# Altium project WS3.0.PrjPCB
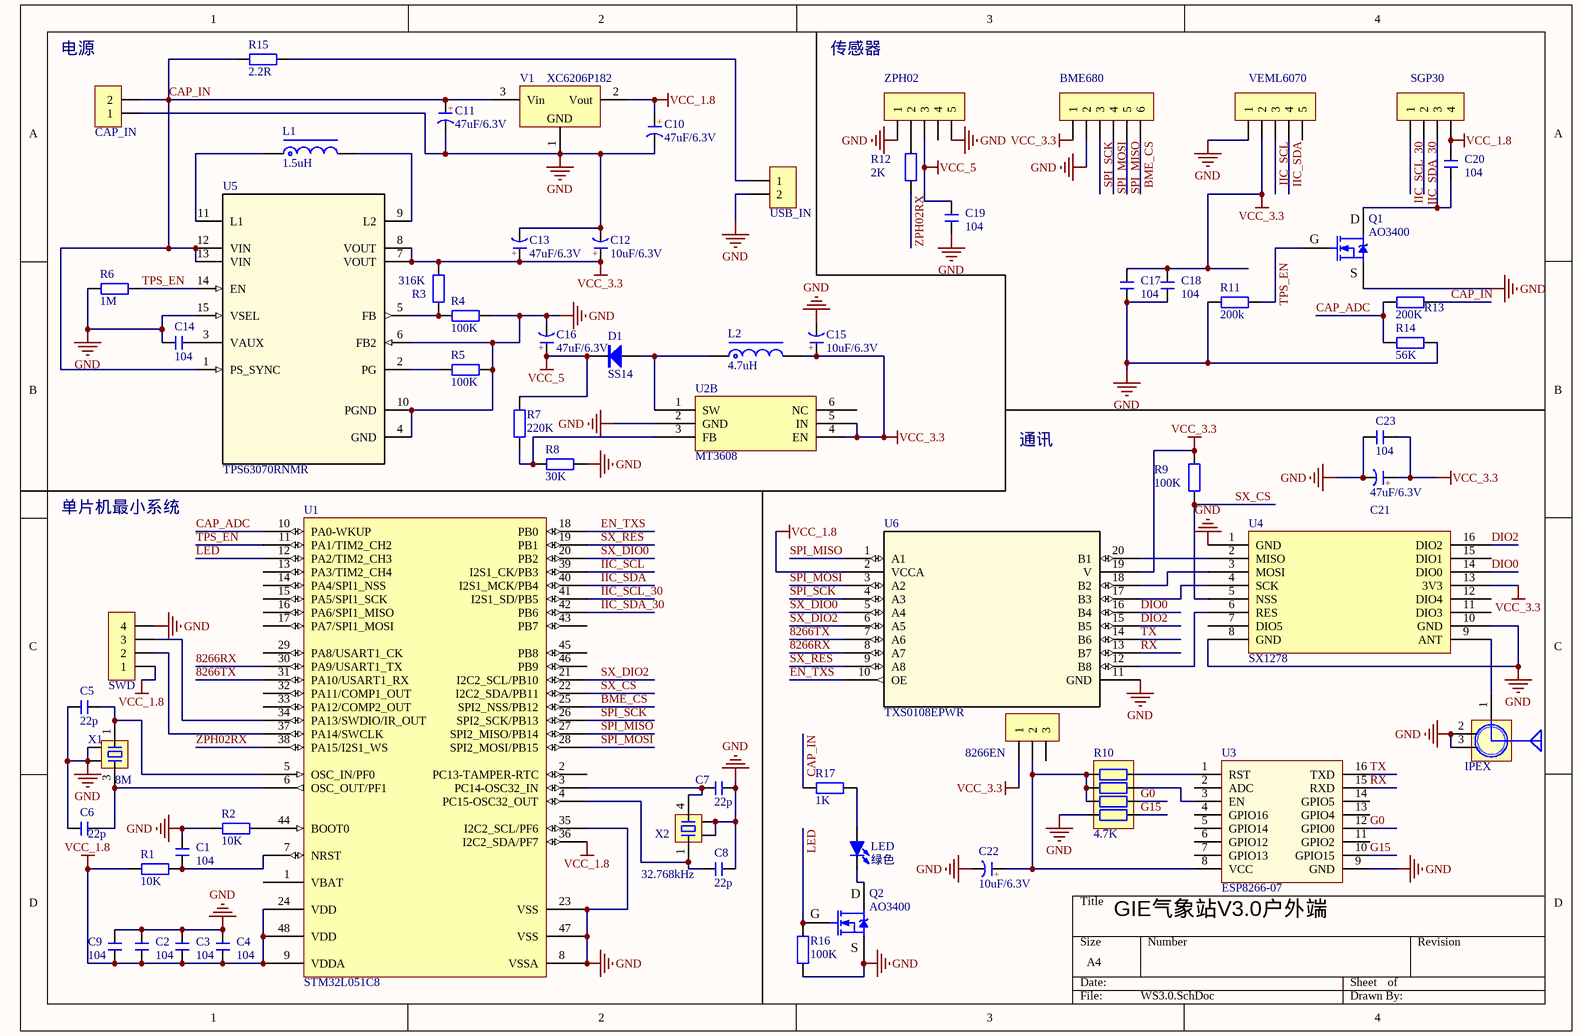
[diagram p0: WS3.0.SchDoc]
2 sheets, 120 parts. Net scope: global (net labels, ports and power ports of the same name join across sheets).
Board files: WS3.0.PcbDoc, WS3.0_DISP.PcbDoc
Sheets:
  WS3.0.SchDoc
  WS3.0_DISP.SchDoc

## Sheet WS3.0.SchDoc
size A4

### Parts
(Parts that share a designator on the sheet are numbered #1, #2 ... from top to bottom, then left to right.)
8266EN  HDR-1X3  [HDR2.54-LI-3P]  (value not drawn)
?  IPEX  [IPEX]
BME680  HDR-1X6  [HDR2.54-LI-6P]  (value not drawn)
C1#1  104  [C 0603_L]
C2#1  104  [C 0603_L]
C3#1  104  [C 0603_L]
C4#1  104  [C 0603_L]
C5#1  22p  [C 0603_L]
C6#1  22p  [C 0603_L]
C7#1  22p  [C 0603_L]
C8#1  22p  [C 0603_L]
C9#1  104  [C 0603_L]
C10#1  47uF/6.3V  [CD A(3216)]
C11#1  47uF/6.3V  [CD A(3216)]
C12#1  10uF/6.3V  [CD S(2012)]
C13#1  47uF/6.3V  [CD A(3216)]
C14#1  104  [C 0603_L]
C15#1  10uF/6.3V  [CD S(2012)]
C16#1  47uF/6.3V  [CD A(3216)]
C17#1  104  [C 0603_L]
C18#1  104  [C 0603_L]
C19#1  104  [C 0603_L]
C20#1  104  [C 0603_L]
C21#1  47uF/6.3V  [CD A(3216)]
C22#1  10uF/6.3V  [CD S(2012)]
C23  104  [C 0603_L]
CAP_IN  HDR-1X2  [HDR2.54-LI-2P]  (value not drawn)
D1  SS14  [SOD-523]
L1  1.5uH  [NR4020]
L2  4.7uH  [L-SMD-0630]
LED  绿色  [LED 0805G]
Q1#1  AO3400  [SOT23-3N]
Q2#1  AO3400  [SOT23-3N]
R1#1  10K  [R 0603_L]
R2#1  10K  [R 0603_L]
R3  316K  [R 0603_L]
R4#1  100K  [R 0603_L]
R5#1  100K  [R 0603_L]
R6#1  1M  [R 0603_L]
R7#1  220K  [R 0603_L]
R8#1  30K  [R 0603_L]
R9#1  100K  [R 0603_L]
R10#1  4.7K  [RCA-8P4R-0603]
R11#1  200k  [R 0603_L]
R12#1  2K  [R 0603_L]
R13#1  200K  [R 0603_L]
R14#1  56K  [R 0603_L]
R15  2.2R  [RS 3W]
R16  100K  [R 0603_L]
R17  1K  [R 0603_L]
SGP30  HDR-1X4  [HDR2.54-LI-4P]  (value not drawn)
SWD#1  HDR-1X4  [HDR2.54-LI-4P]  (value not drawn)
U1#1  STM32L051C8  [LQFP48 7X7_M]
U2#1  MT3608  [SOT23-6L]  (part B of 2)
U3#1  ESP8266-07  [ESP-07]
U4#1  SX1278  [SX1278]
U5#1  TPS63070RNMR  [RNM0015A]
U6#1  TXS0108EPWR  [PW20]
USB_IN  HDR-1X2  [HDR2.54-LI-2P]  (value not drawn)
V1#1  XC6206P182  [SOT23-3M]
VEML6070  HDR-1X5  [HDR2.54-LI-5P]  (value not drawn)
X1#1  8M  [OSC 3225-4P]
X2#1  32.768kHz  [OSC MC-146]
ZPH02  HDR-1X5  [HDR2.54-LI-5P]  (value not drawn)

### Nets
GND: ?.2(GND) ?.3(GND) BME680.2 C1#1.2 C2#1.2 C3#1.2 C4#1.2 C5#1.1 C6#1.1 C7#1.2 C8#1.2 C9#1.2 C10#1.2(K) C11#1.2(K) C12#1.2(K) C13#1.2(K) C14#1.2 C15#1.2(K) C16#1.2(K) C17#1.1 C18#1.1 C19#1.1 C21#1.2(K) C22#1.2(K) C23.2 CAP_IN.1 Q1#1.2(S) Q2#1.2(S) R2#1.1 R4#1.2 R5#1.2 R6#1.1 R8#1.2 R10#1.4 R11#1.2 R14#1.1 R16.2 SWD#1.4 U1#1.8(VSSA) U1#1.23(VSS) U1#1.35(I2C2_SCL/PF6) U1#1.47(VSS) U2#1.2(GND) U3#1.9(GND) U4#1.1(GND) U4#1.8(GND) U4#1.10(GND) U5#1.4(GND) U5#1.6(FB2) U5#1.10(PGND) U5#1.15(VSEL) U6#1.11(GND) USB_IN.2 V1#1.1(GND) VEML6070.1 X1#1.2 X1#1.4 X2#1.2 X2#1.3 ZPH02.1 ZPH02.5
VCC_1.8: C2#1.1 C3#1.1 C4#1.1 C9#1.1 C10#1.1(A) C20#1.2 R1#1.1 SGP30.4 SWD#1.1 U1#1.9(VDDA) U1#1.24(VDD) U1#1.36(I2C2_SDA/PF7) U1#1.48(VDD) U6#1.2(VCCA) V1#1.2(Vout)
VCC_3.3: 8266EN.1 BME680.1 C12#1.1(A) C13#1.1(A) C15#1.1(A) C17#1.2 C18#1.2 C21#1.1(A) C23.1 L2.2 R3.2 R9#1.2 U2#1.4(EN) U2#1.5(IN) U4#1.13(3V3) U5#1.7(VOUT) U5#1.8(VOUT) U6#1.19(V) VEML6070.2
VCC_5: C16#1.1(A) C19#1.2 D1.2(K) R7#1.2 ZPH02.3
8266RX: U1#1.30(PA9/USART1_TX) U6#1.8(A7)
8266TX: U1#1.31(PA10/USART1_RX) U6#1.7(A6)
BME_CS: BME680.6 U1#1.25(SPI2_NSS/PB12)
CAP_ADC: R13#1.2 R14#1.2 U1#1.10(PA0-WKUP)
CAP_IN: C11#1.1(A) CAP_IN.2 R13#1.1 R15.1 R17.2 U5#1.1(PS_SYNC) U5#1.12(VIN) U5#1.13(VIN) V1#1.3(Vin)
DIO0: U4#1.14(DIO0) U6#1.16(B4)
DIO2: U4#1.16(DIO2) U6#1.15(B5)
EN_TXS: U1#1.18(PB0) U6#1.10(OE)
G0: R10#1.6 U3#1.12(GPIO0)
G15: R10#1.5 U3#1.10(GPIO15)
IIC_SCL: U1#1.39(I2S1_CK/PB3) VEML6070.3
IIC_SCL_30: SGP30.1 U1#1.41(I2S1_SD/PB5)
IIC_SDA: U1#1.40(I2S1_MCK/PB4) VEML6070.4
IIC_SDA_30: SGP30.2 U1#1.42(PB6)
LED: Q2#1.1(G) R16.1 U1#1.12(PA2/TIM2_CH3)
RX: U3#1.15(RXD) U6#1.13(B7)
SPI_MISO: BME680.5 U1#1.27(SPI2_MISO/PB14) U6#1.1(A1)
SPI_MOSI: BME680.4 U1#1.28(SPI2_MOSI/PB15) U6#1.3(A2)
SPI_SCK: BME680.3 U1#1.26(SPI2_SCK/PB13) U6#1.4(A3)
SX_CS: R9#1.1 U1#1.22(I2C2_SDA/PB11) U4#1.5(NSS)
SX_DIO0: U1#1.20(PB2) U6#1.5(A4)
SX_DIO2: U1#1.21(I2C2_SCL/PB10) U6#1.6(A5)
SX_RES: U1#1.19(PB1) U6#1.9(A8)
TPS_EN: Q1#1.1(G) R6#1.2 R11#1.1 U1#1.11(PA1/TIM2_CH2) U5#1.14(EN)
TX: U3#1.16(TXD) U6#1.14(B6)
ZPH02RX: R12#1.1 U1#1.38(PA15/I2S1_WS)
Net8266EN_2: 8266EN.2 C22#1.1(A) R10#1.1 R10#1.2 R10#1.3 U3#1.8(VCC)
Net?_1: ?.1(ANT) U4#1.9(ANT)
NetC1#1_1: C1#1.1 R1#1.2 U1#1.7(NRST)
NetC5#1_2: C5#1.2 U1#1.5(OSC_IN/PF0) X1#1.1
NetC6#1_2: C6#1.2 U1#1.6(OSC_OUT/PF1) X1#1.3
NetC7#1_1: C7#1.1 U1#1.3(PC14-OSC32_IN) X2#1.4
NetC8#1_1: C8#1.1 U1#1.4(PC15-OSC32_OUT) X2#1.1
NetC14#1_1: C14#1.1 U5#1.3(VAUX)
NetC20#1_1: C20#1.1 Q1#1.3(D) SGP30.3
NetD1_1: D1.1(A) L2.1 U2#1.1(SW)
NetL1_1: L1.1 U5#1.11(L1)
NetL1_2: L1.2 U5#1.9(L2)
NetLED_1: LED.1(A) R17.1
NetLED_2: LED.2(K) Q2#1.3(D)
NetR2#1_2: R2#1.2 U1#1.44(BOOT0)
NetR3_1: R3.1 R4#1.1 U5#1.5(FB)
NetR5#1_1: R5#1.1 U5#1.2(PG)
NetR7#1_1: R7#1.1 R8#1.1 U2#1.3(FB)
NetR10#1_7: R10#1.7 U3#1.3(EN)
NetR10#1_8: R10#1.8 U3#1.1(RST)
NetR12#1_2: R12#1.2 ZPH02.2
NetR15_2: R15.2 USB_IN.1
NetSWD#1_2: SWD#1.2 U1#1.37(PA14/SWCLK)
NetSWD#1_3: SWD#1.3 U1#1.34(PA13/SWDIO/IR_OUT)
NetU4#1_2: U4#1.2(MISO) U6#1.20(B1)
NetU4#1_3: U4#1.3(MOSI) U6#1.18(B2)
NetU4#1_4: U4#1.4(SCK) U6#1.17(B3)
NetU4#1_6: U4#1.6(RES) U6#1.12(B8)

Not connected (* = marked no-connect by the designer): 8266EN 3; U1#1 1(VBAT) 2(PC13-TAMPER-RTC) 13(PA3/TIM2_CH4) 14(PA4/SPI1_NSS) 15(PA5/SPI1_SCK) 16(PA6/SPI1_MISO) 17(PA7/SPI1_MOSI) 29(PA8/USART1_CK) 32(PA11/COMP1_OUT) 33(PA12/COMP2_OUT) 43(PB7) 45(PB8) 46(PB9); U2#1 6(NC); U3#1 2(ADC) 4(GPIO16) 5(GPIO14) 6(GPIO12) 7(GPIO13) 11(GPIO2) 13(GPIO4) 14(GPIO5); U4#1 7(DIO5) 11(DIO3) 12(DIO4) 15(DIO1); VEML6070 5; ZPH02 4

### Notes on the sheet
- 电源
- 传感器
- 通讯
- 单片机最小系统
- (near U3#1) GIE气象站V3.0户外端
- (in symbol C-CD) +

### Library data of the parts
8266EN = Header 3: 3P接插件; 版权归属: 源创客; BOM名称: 3P接插件; 学习资源: www.ooocke.com
? = SMA: SMA-2.4G射频天线接口; 版权归属: 源创客; BOM名称: SMA-2.4G射频天线接口; 学习资源: www.ooocke.com
BME680 = Header 6: 6P接插件; 版权归属: 源创客; BOM名称: 6P接插件; 学习资源: www.ooocke.com
C1#1 C2#1 C3#1 C4#1 C5#1 C6#1 C7#1 C8#1 C9#1 C14#1 C17#1 C18#1 C19#1 C20#1 C23 = C: 无极性贴片电容; 版权归属: 源创客; BOM名称: 无极性贴片电容; 学习资源: www.ooocke.com
C10#1 C11#1 C12#1 C13#1 C15#1 C16#1 C21#1 C22#1 = C-CD: 贴片钽电容; 版权归属: 源创客; BOM名称: 贴片钽电容; 学习资源: www.ooocke.com
CAP_IN USB_IN = Header 2: 2P接插件; 版权归属: 源创客; BOM名称: 2P接插件; 学习资源: www.ooocke.com
D1 = SS14: 肖特基二极管; 版权归属: 源创客; 属性: 40V/1A; BOM名称: 肖特基二极管; 学习资源: www.ooocke.com
L1 L2 = L-NR: NR磁胶电感; 版权归属: 源创客; BOM名称: NR磁胶电感; 学习资源: www.ooocke.com
LED = LED-SMD: 贴片LED; 版权归属: 源创客; BOM名称: 贴片LED; 学习资源: www.ooocke.com
Q1#1 Q2#1 = SI2302: N沟道场效应管; 版权归属: 源创客; BOM名称: N沟道场效应管; 学习资源: www.ooocke.com
R1#1 R2#1 R3 R4#1 R5#1 R6#1 R7#1 R8#1 R9#1 R11#1 R12#1 R13#1 R14#1 R16 R17 = R: 贴片电阻; 版权归属: 源创客; BOM名称: 贴片电阻; 学习资源: www.ooocke.com
R10#1 = R-8P4R: 贴片网络排阻; 版权归属: 源创客; BOM名称: 贴片网络排阻; 学习资源: www.ooocke.com
R15 = R-I: 电流检测电阻; 版权归属: 源创客; BOM名称: 电流检测电阻; 学习资源: www.ooocke.com
SGP30 SWD#1 = Header 4: 4P接插件; 版权归属: 源创客; BOM名称: 4P接插件; 学习资源: www.ooocke.com
U1#1 = STM32F051C8: Flaah:64/RAM:20/IO:36; BOM名称: 32位STM单片机; 版权归属: 源创客; 学习资源: www.ooocke.com
U3#1 = ESP8266-07: 串口 WIFI模块，ESP-07; BOM名称: WIFI模块; 版权归属: 源创客; 学习资源: www.ooocke.com
U5#1 = TPS630701RNMR: No Description Available; Manufacturer: Texas Instruments; PartNumber: TPS63070RNMR; RefDes: RefDes; Type: DEV; Value: Value; Copyright: Copyright (C) 2018 Accelerated Designs. All rights reserved
U6#1 = TXS0108EPWR: 8-Bit Bidirectional Voltage-Level Translator For Open-Drain And Push-Pull Application; Vendor: Texas Instruments; PACKAGE_DESIGNATOR: PW; PIN_COUNT: 20; FAMILY_NAME: AUTO DIRECTION SENSING DUAL SUPPLY TRANSLATOR; INDUSTRY_STD_PKG_TYPE: TSSOP; Manufacturer_Part_Number: TXS0108EPWR; GENERIC_PART_NUMBER: TXS0108E; Datasheet_URL: http://www.ti.com/lit/gpn/TXS0108E; Manufacturer: Texas Instruments; Copyright: Copyright (C) 2018 Accelerated Designs. All rights reserved; RefDes: RefDes; Type: DEV
V1#1 = AMS1117: 三端稳压芯片; BOM名称: 稳压芯片; 版权归属: 源创客; 学习资源: www.ooocke.com
VEML6070 ZPH02 = Header 5: 5P接插件; 版权归属: 源创客; BOM名称: 5P接插件; 学习资源: www.ooocke.com
X1#1 = XTAL-4P: 4脚无源晶振; 版权归属: 源创客; BOM名称: 4脚无源晶振; 学习资源: www.ooocke.com
X2#1 = XTAL-MC-4P: MC系列4脚晶振; BOM名称: 2脚无源脚晶振; 版权归属: 源创客; 学习资源: www.ooocke.com

## Sheet WS3.0_DISP.SchDoc
size A4
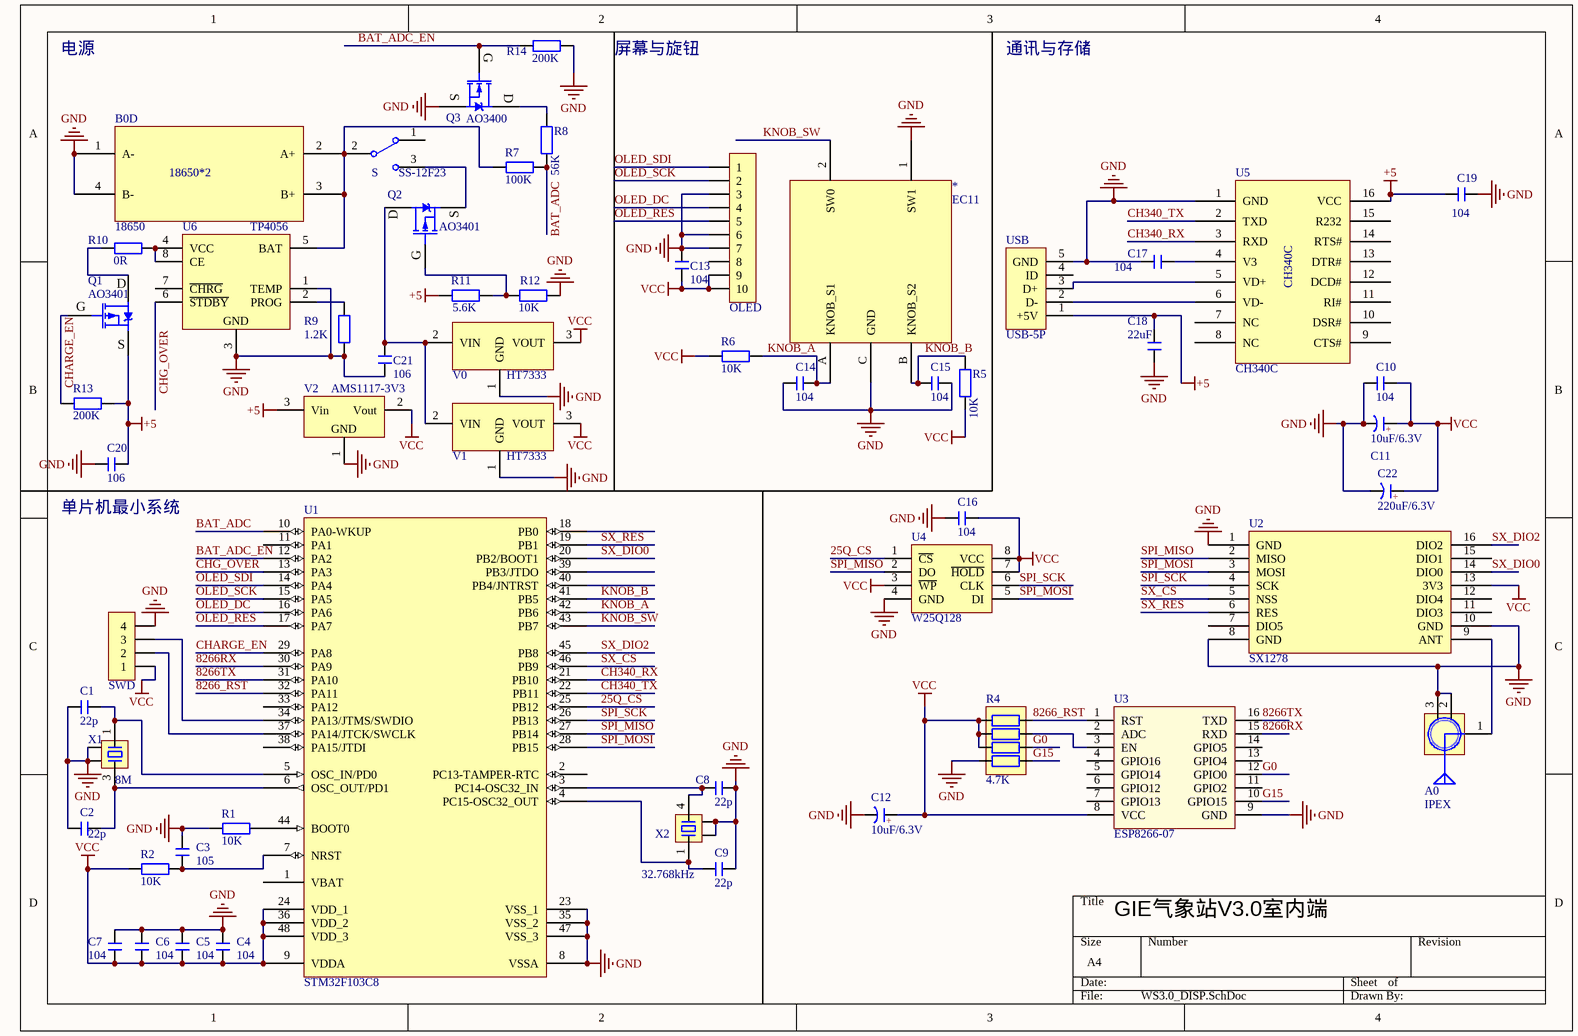
[diagram p1: WS3.0_DISP.SchDoc]

### Parts
(Parts that share a designator on the sheet are numbered #1, #2 ... from top to bottom, then left to right.)
*  EC11  [EC11]
A0  IPEX  [IPEX]
B0  18650  [18650]  (part D of 4)
C1#2  22p  [C 0603_L]
C2#2  22p  [C 0603_L]
C3#2  105  [C 0603_L]
C4#2  104  [C 0603_L]
C5#2  104  [C 0603_L]
C6#2  104  [C 0603_L]
C7#2  104  [C 0603_L]
C8#2  22p  [C 0603_L]
C9#2  22p  [C 0603_L]
C10#2  104  [C 0603_L]
C11#2  10uF/6.3V  [CD S(2012)]
C12#2  10uF/6.3V  [CD S(2012)]
C13#2  104  [C 0603_L]
C14#2  104  [C 0603_L]
C15#2  104  [C 0603_L]
C16#2  104  [C 0603_L]
C17#2  104  [C 0603_L]
C18#2  22uF  [C 0805_L]
C19#2  104  [C 0603_L]
C20#2  106  [C 0805_L]
C21#2  106  [C 0805_L]
C22#2  220uF/6.3V  [CD B(3528)]
OLED  FPC1.0-10P  [FPC1.0-2H-WS-10P]  (value not drawn)
Q1#2  AO3401  [SOT23-3N]
Q2#2  AO3401  [SOT23-3N]
Q3  AO3400  [SOT23-3N]
R1#2  10K  [R 0603_L]
R2#2  10K  [R 0603_L]
R4#2  4.7K  [RCA-8P4R-0603]
R5#2  10K  [R 0603_L]
R6#2  10K  [R 0603_L]
R7#2  100K  [R 0603_L]
R8#2  56K  [R 0603_L]
R9#2  1.2K  [R 0603_L]
R10#2  0R  [R 1206_L]
R11#2  5.6K  [R 0603_L]
R12#2  10K  [R 0603_L]
R13#2  200K  [R 0603_L]
R14#2  200K  [R 0603_L]
S  SS-12F23  [SS-12F23]
SWD#2  HDR-1X4  [HDR2.54-LI-4P]  (value not drawn)
U1#2  STM32F103C8  [LQFP48 7X7_M]
U2#2  SX1278  [SX1278]
U3#2  ESP8266-07  [ESP-07]
U4#2  W25Q128  [SOP8W_N]
U5#2  CH340C  [SOP16_N]
U6#2  TP4056  [SOP8_N]
USB  USB-5P  [USB-MICRO_A]
V0  HT7333  [SOT89_N]
V1#2  HT7333  [SOT89_N]
V2  AMS1117-3V3  [SOT223_L]
X1#2  8M  [OSC 3225-4P]
X2#2  32.768kHz  [OSC MC-146]

### Nets
+5: C18#2.2 C19#2.1 C20#2.1 Q1#2.2(S) R11#2.1 R13#2.1 U5#2.16(VCC) USB.1(+5V) V2.3(Vin)
GND: *.1(SW1) *.C(GND) A0.2(GND) A0.3(GND) B0.1(A-) B0.4(B-) C1#2.1 C2#2.1 C3#2.2 C4#2.2 C5#2.2 C6#2.2 C7#2.2 C8#2.2 C9#2.2 C10#2.2 C11#2.2(K) C12#2.2(K) C13#2.1 C14#2.2 C15#2.1 C16#2.2 C17#2.2 C18#2.1 C19#2.2 C20#2.2 C21#2.2 C22#2.2(K) OLED.3 OLED.6 OLED.7 Q3.2(S) R1#2.1 R4#2.4 R9#2.1 R12#2.2 R14#2.1 SWD#2.4 U1#2.8(VSSA) U1#2.23(VSS_1) U1#2.35(VSS_2) U1#2.47(VSS_3) U2#2.1(GND) U2#2.8(GND) U2#2.10(GND) U3#2.9(GND) U4#2.4(GND) U5#2.1(GND) U6#2.1(TEMP) U6#2.3(GND) USB.5(GND) V0.1(GND) V1#2.1(GND) V2.1(GND) X1#2.2 X1#2.4 X2#2.2 X2#2.3
VCC: C4#2.1 C5#2.1 C6#2.1 C7#2.1 C10#2.1 C11#2.1(A) C12#2.1(A) C13#2.2 C16#2.1 C22#2.1(A) OLED.9 OLED.10 R2#2.1 R4#2.1 R4#2.2 R4#2.3 R5#2.1 R6#2.2 SWD#2.1 U1#2.9(VDDA) U1#2.24(VDD_1) U1#2.36(VDD_2) U1#2.48(VDD_3) U2#2.13(3V3) U3#2.8(VCC) U4#2.3(~{WP}) U4#2.7(~{HOLD}) U4#2.8(VCC) V0.3(VOUT) V1#2.3(VOUT) V2.2(Vout)
25Q_CS: U1#2.25(PB12) U4#2.1(~{CS})
8266_RST: R4#2.8 U1#2.32(PA11) U3#2.1(RST)
8266RX: U1#2.30(PA9) U3#2.15(RXD)
8266TX: U1#2.31(PA10) U3#2.16(TXD)
BAT_ADC: R7#2.1 R8#2.1 U1#2.10(PA0-WKUP)
BAT_ADC_EN: Q3.1(G) R14#2.2 U1#2.12(PA2)
CH340_RX: U1#2.21(PB10) U5#2.3(RXD)
CH340_TX: U1#2.22(PB11) U5#2.2(TXD)
CHARGE_EN: Q1#2.1(G) R13#2.2 U1#2.29(PA8)
CHG_OVER: U1#2.13(PA3) U6#2.6(~{STDBY})
G0: R4#2.6 U3#2.12(GPIO0)
G15: R4#2.5 U3#2.10(GPIO15)
KNOB_A: *.A(KNOB_S1) C14#2.1 R6#2.1 U1#2.42(PB6)
KNOB_B: *.B(KNOB_S2) C15#2.2 R5#2.2 U1#2.41(PB5)
KNOB_SW: *.2(SW0) U1#2.43(PB7)
OLED_DC: OLED.4 U1#2.16(PA6)
OLED_RES: OLED.5 U1#2.17(PA7)
OLED_SCK: OLED.2 U1#2.15(PA5)
OLED_SDI: OLED.1 U1#2.14(PA4)
SPI_MISO: U1#2.27(PB14) U2#2.2(MISO) U4#2.2(DO)
SPI_MOSI: U1#2.28(PB15) U2#2.3(MOSI) U4#2.5(DI)
SPI_SCK: U1#2.26(PB13) U2#2.4(SCK) U4#2.6(CLK)
SX_CS: U1#2.46(PB9) U2#2.5(NSS)
SX_DIO0: U1#2.20(PB2/BOOT1) U2#2.14(DIO0)
SX_DIO2: U1#2.45(PB8) U2#2.16(DIO2)
SX_RES: U1#2.19(PB1) U2#2.6(RES)
NetA0_1: A0.1(ANT) U2#2.9(ANT)
NetB0_2: B0.2(A+) B0.3(B+) R7#2.2 S.2 U6#2.5(BAT)
NetC1#2_2: C1#2.2 U1#2.5(OSC_IN/PD0) X1#2.1
NetC2#2_2: C2#2.2 U1#2.6(OSC_OUT/PD1) X1#2.3
NetC3#2_1: C3#2.1 R2#2.2 U1#2.7(NRST)
NetC8#2_1: C8#2.1 U1#2.3(PC14-OSC32_IN) X2#2.4
NetC9#2_1: C9#2.1 U1#2.4(PC15-OSC32_OUT) X2#2.1
NetC17#2_1: C17#2.1 U5#2.4(V3)
NetC21#2_1: C21#2.1 Q2#2.3(D) V0.2(VIN) V1#2.2(VIN)
NetQ1#2_3: Q1#2.3(D) R10#2.2
NetQ2#2_1: Q2#2.1(G) R11#2.2 R12#2.1
NetQ2#2_2: Q2#2.2(S) S.3
NetQ3_3: Q3.3(D) R8#2.2
NetR1#2_2: R1#2.2 U1#2.44(BOOT0)
NetR4#2_7: R4#2.7 U3#2.3(EN)
NetR9#2_2: R9#2.2 U6#2.2(PROG)
NetR10#2_1: R10#2.1 U6#2.4(VCC) U6#2.8(CE)
NetSWD#2_2: SWD#2.2 U1#2.37(PA14/JTCK/SWCLK)
NetSWD#2_3: SWD#2.3 U1#2.34(PA13/JTMS/SWDIO)
NetU5#2_5: U5#2.5(VD+) USB.3(D+)
NetU5#2_6: U5#2.6(VD-) USB.2(D-)

Not connected (* = marked no-connect by the designer): OLED 8; S 1; U1#2 1(VBAT) 2(PC13-TAMPER-RTC) 11(PA1) 18(PB0) 33(PA12) 38(PA15/JTDI) 39(PB3/JTDO) 40(PB4/JNTRST); U2#2 7(DIO5) 11(DIO3) 12(DIO4) 15(DIO1); U3#2 2(ADC) 4(GPIO16) 5(GPIO14) 6(GPIO12) 7(GPIO13) 11(GPIO2) 13(GPIO4) 14(GPIO5); U5#2 7(NC) 8(NC) 9(CTS#) 10(DSR#) 11(RI#) 12(DCD#) 13(DTR#) 14(RTS#) 15(R232); U6#2 7(~{CHRG}); USB 4(ID)

### Notes on the sheet
- 电源
- 屏幕与旋钮
- 通讯与存储
- (near C20#2) 单片机最小系统
- GIE气象站V3.0室内端
- (in symbol 18650, part D) 18650*2
- (in symbol C-CD) +

### Library data of the parts
A0 = SMA: SMA-2.4G射频天线接口; 版权归属: 源创客; BOM名称: SMA-2.4G射频天线接口; 学习资源: www.ooocke.com
C1#2 C2#2 C3#2 C4#2 C5#2 C6#2 C7#2 C8#2 C9#2 C10#2 C13#2 C14#2 C15#2 C16#2 C17#2 C18#2 C19#2 C20#2 C21#2 = C: 无极性贴片电容; 版权归属: 源创客; BOM名称: 无极性贴片电容; 学习资源: www.ooocke.com
C11#2 C12#2 C22#2 = C-CD: 贴片钽电容; 版权归属: 源创客; BOM名称: 贴片钽电容; 学习资源: www.ooocke.com
OLED = FPC-10P: FPC连接器; 版权归属: 源创客; BOM名称: FPC连接器; 学习资源: www.ooocke.com
Q1#2 Q2#2 = SI2301: P沟道场效应管; 版权归属: 源创客; BOM名称: P沟道场效应管; 学习资源: www.ooocke.com
Q3 = SI2302: N沟道场效应管; 版权归属: 源创客; BOM名称: N沟道场效应管; 学习资源: www.ooocke.com
R1#2 R2#2 R5#2 R6#2 R7#2 R8#2 R9#2 R10#2 R11#2 R12#2 R13#2 R14#2 = R: 贴片电阻; 版权归属: 源创客; BOM名称: 贴片电阻; 学习资源: www.ooocke.com
R4#2 = R-8P4R: 贴片网络排阻; 版权归属: 源创客; BOM名称: 贴片网络排阻; 学习资源: www.ooocke.com
S = SSW-1P: 1路波动开关; BOM名称: 波动开关; 版权归属: 源创客; 学习资源: www.ooocke.com
SWD#2 = Header 4: 4P接插件; 版权归属: 源创客; BOM名称: 4P接插件; 学习资源: www.ooocke.com
U1#2 = STM32F103C8: Flaah:64/RAM:20/IO:36; BOM名称: 32位STM单片机; 版权归属: 源创客; 学习资源: www.ooocke.com
U3#2 = ESP8266-07: as U3#1 on sheet WS3.0; 学习资源: www.ooocke.com
U4#2 = W25Qxx: 外置Flash; 版权归属: 源创客; BOM名称: 外置Flash; 学习资源: www.ooocke.com
U6#2 = TP4056: 锂电池充电管理; 版权归属: 源创客; BOM名称: 锂电池充电管理; 学习资源: www.ooocke.com
USB = USB-5P: 微型USB母座; 版权归属: 源创客; BOM名称: 微型USB母座; 学习资源: www.ooocke.com
V0 V1#2 = HT71xx: LDO线性稳压芯片; 版权归属: 源创客; BOM名称: LDO线性稳压芯片; 学习资源: www.ooocke.com
V2 = AMS1117: 三端稳压芯片; BOM名称: 稳压芯片; 版权归属: 源创客; 学习资源: www.ooocke.com
X1#2 = XTAL-4P: 4脚无源晶振; 版权归属: 源创客; BOM名称: 4脚无源晶振; 学习资源: www.ooocke.com
X2#2 = XTAL-MC-4P: MC系列4脚晶振; BOM名称: 2脚无源脚晶振; 版权归属: 源创客; 学习资源: www.ooocke.com

## Nets that join several sheets
GND: WS3.0 (61 pins), WS3.0_DISP (58 pins)
8266RX: WS3.0 (U1#1.30 U6#1.8), WS3.0_DISP (U1#2.30 U3#2.15)
8266TX: WS3.0 (U1#1.31 U6#1.7), WS3.0_DISP (U1#2.31 U3#2.16)
G0: WS3.0 (R10#1.6 U3#1.12), WS3.0_DISP (R4#2.6 U3#2.12)
G15: WS3.0 (R10#1.5 U3#1.10), WS3.0_DISP (R4#2.5 U3#2.10)
SPI_MISO: WS3.0 (BME680.5 U1#1.27 U6#1.1), WS3.0_DISP (U1#2.27 U2#2.2 U4#2.2)
SPI_MOSI: WS3.0 (BME680.4 U1#1.28 U6#1.3), WS3.0_DISP (U1#2.28 U2#2.3 U4#2.5)
SPI_SCK: WS3.0 (BME680.3 U1#1.26 U6#1.4), WS3.0_DISP (U1#2.26 U2#2.4 U4#2.6)
SX_CS: WS3.0 (R9#1.1 U1#1.22 U4#1.5), WS3.0_DISP (U1#2.46 U2#2.5)
SX_DIO0: WS3.0 (U1#1.20 U6#1.5), WS3.0_DISP (U1#2.20 U2#2.14)
SX_DIO2: WS3.0 (U1#1.21 U6#1.6), WS3.0_DISP (U1#2.45 U2#2.16)
SX_RES: WS3.0 (U1#1.19 U6#1.9), WS3.0_DISP (U1#2.19 U2#2.6)